# EAGLE schematic k1fm-gps-breakout (EAGLE 9.4.1)
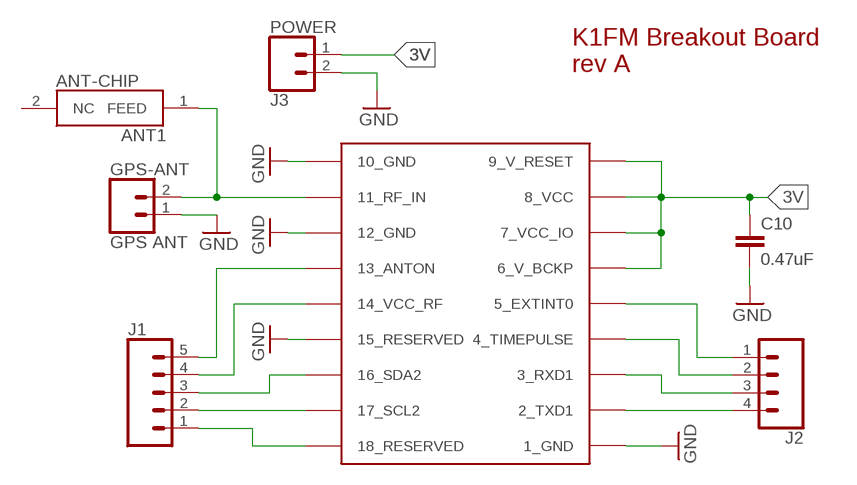
[diagram p0: schematic, sheet 1]

## Parts
ANT-CHIP  ANT1  1575AT43A0040E  [1575AT43A0040E]
C10  0.47uF  0.1UF-0603-25V-5%  [0603]
GPS1  UBLOX_MAX  [UBLOX_MAX]
GPS-ANT  GPS ANT  CONN_02  [1X02]
J1  CONN_05  [1X05]
J2  CONN_04  [1X04]
J3  POWER  CONN_02  [1X02]

## Nets
3V: C10.1 GPS1.6_V_BCKP GPS1.7_VCC_IO GPS1.8_VCC GPS1.9_V_RESET J3.1
GND: C10.2 GPS1.1_GND GPS1.10_GND GPS1.12_GND GPS1.15_RESERVED GPS-ANT.1 J3.2
N$1: GPS1.4_TIMEPULSE J2.2
N$2: GPS1.3_RXD1 J2.3
N$3: GPS1.2_TXD1 J2.4
N$5: GPS1.5_EXTINT0 J2.1
N$6: ANT-CHIP.1(FEED) GPS1.11_RF_IN GPS-ANT.2
N$7: GPS1.18_RESERVED J1.1
N$8: GPS1.17_SCL2 J1.2
N$9: GPS1.16_SDA2 J1.3
N$10: GPS1.13_ANTON J1.5
N$11: GPS1.14_VCC_RF J1.4
Unconnected: ANT-CHIP.2(NC)

## Notes on the sheet
- K1FM Breakout Board
  rev A

## Library data of the parts
ANT-CHIP = samacsys_parts:1575AT43A0040E: Tri-Band GPS, BDS, and GLNSS, Low Cost, Linearly Polarized, Omnidirectional Chip Antenna Source: Datasheet <https://componentsearchengine.com/Datasheets/1/1575AT43A0040E.pdf>; DESCRIPTION: Tri-Band GPS, BDS, and GLNSS, Low Cost, Linearly Polarized, Omnidirectional Chip Antenna; HEIGHT: mm; MANUFACTURER_NAME: JOHANSON TECHNOLOGY; MANUFACTURER_PART_NUMBER: 1575AT43A0040E; MOUSER_PART_NUMBER: 609-1575AT43A0040E; MOUSER_PRICE-STOCK: https://www.mouser.com/Search/Refine.aspx?Keyword=609-1575AT43A0040E
C10 = SparkFun-Capacitors:0.1UF: 0.1µF ceramic capacitors A capacitor is a passive two-terminal electrical component used to store electrical energy temporarily in an electric field.; PROD_ID: CAP-08604; VALUE: 0.1uF
GPS1 = Ava:UBLOX_MAX: UBLOX MAX
GPS-ANT J3 = SparkFun-Connectors:CONN_02: Multi connection point. Often used as Generic Header-pin footprint for 0.1 inch spaced/style header connections On any of the 0.1 inch spaced packages, you can populate with these: Break Away Headers - Straight <https://www.sparkfun.com/products/116> (PRT-00116) Break Away Male Headers - Right Angle <https://www.sparkfun.com/products/553> (PRT-00553) Female Headers <https://www.sparkfun.com/products/115> (PRT-00115) Break Away Headers - Machine Pin <https://www.sparkfun.com/products/117> (PRT-00117) Break Away Female Headers - Swiss Machine Pin <https://www.sparkfun.com/products/743> (PRT-00743) For SCREWTERMINALS and SPRING TERMINALS visit here: Screw Terimnals on SparkFun.com <https://www.sparkfun.com/search/results?term=Screw+Terminals> (5mm/3.5mm/2.54mm spacing) This device is also useful as a general connection point to wire up your design to another part of your project. Our various solder wires solder well into these plated through hole pads. Hook-Up Wire - Assortment (Stranded, 22 AWG) <https://www.sparkfun.com/products/11375> (PRT-11375) Hook-Up Wire - Assortment (Solid Core, 22 AWG) <https://www.sparkfun.com/products/11367> (PRT-11367) View the entire wire category on our website here <https://www.sparkfun.com/categories/141> Special notes: Molex polarized connector foot print use with: PRT-08233 with associated crimp pins and housings. 2.54_SCREWTERM for use with PRT-10571. 3.5mm Screw Terminal footprints for PRT-08084 5mm Screw Terminal footprints for use with PRT-08432
J1 = SparkFun-Connectors:CONN_05: Multi connection point. Often used as Generic Header-pin footprint for 0.1 inch spaced/style header connections On any of the 0.1 inch spaced packages, you can populate with these: Break Away Headers - Straight <https://www.sparkfun.com/products/116> (PRT-00116) Break Away Male Headers - Right Angle <https://www.sparkfun.com/products/553> (PRT-00553) Female Headers <https://www.sparkfun.com/products/115> (PRT-00115) Break Away Headers - Machine Pin <https://www.sparkfun.com/products/117> (PRT-00117) Break Away Female Headers - Swiss Machine Pin <https://www.sparkfun.com/products/743> (PRT-00743) For SCREWTERMINALS and SPRING TERMINALS visit here: Screw Terimnals on SparkFun.com <https://www.sparkfun.com/search/results?term=Screw+Terminals> (5mm/3.5mm/2.54mm spacing) This device is also useful as a general connection point to wire up your design to another part of your project. Our various solder wires solder well into these plated through hole pads. Hook-Up Wire - Assortment (Stranded, 22 AWG) <https://www.sparkfun.com/products/11375> (PRT-11375) Hook-Up Wire - Assortment (Solid Core, 22 AWG) <https://www.sparkfun.com/products/11367> (PRT-11367) View the entire wire category on our website here <https://www.sparkfun.com/categories/141> Special notes: Molex polarized connector foot print use with SKU : PRT-08231 with associated crimp pins and housings. 1MM SMD Version SKU: PRT-10208
J2 = SparkFun-Connectors:CONN_04: Multi connection point. Often used as Generic Header-pin footprint for 0.1 inch spaced/style header connections On any of the 0.1 inch spaced packages, you can populate with these: Break Away Headers - Straight <https://www.sparkfun.com/products/116> (PRT-00116) Break Away Male Headers - Right Angle <https://www.sparkfun.com/products/553> (PRT-00553) Female Headers <https://www.sparkfun.com/products/115> (PRT-00115) Break Away Headers - Machine Pin <https://www.sparkfun.com/products/117> (PRT-00117) Break Away Female Headers - Swiss Machine Pin <https://www.sparkfun.com/products/743> (PRT-00743) For SCREWTERMINALS and SPRING TERMINALS visit here: Screw Terimnals on SparkFun.com <https://www.sparkfun.com/search/results?term=Screw+Terminals> (5mm/3.5mm/2.54mm spacing) This device is also useful as a general connection point to wire up your design to another part of your project. Our various solder wires solder well into these plated through hole pads. Hook-Up Wire - Assortment (Stranded, 22 AWG) <https://www.sparkfun.com/products/11375> (PRT-11375) Hook-Up Wire - Assortment (Solid Core, 22 AWG) <https://www.sparkfun.com/products/11367> (PRT-11367) View the entire wire category on our website here <https://www.sparkfun.com/categories/141> Special notes: Molex polarized connector foot print use with SKU : PRT-08231 with associated crimp pins and housings. 1MM SMD Version SKU: PRT-10208; PROD_ID: CONN-09696

## Net classes
1 vcc: width 0.254 mm